# EAGLE design tako (EAGLE 7.3.0)
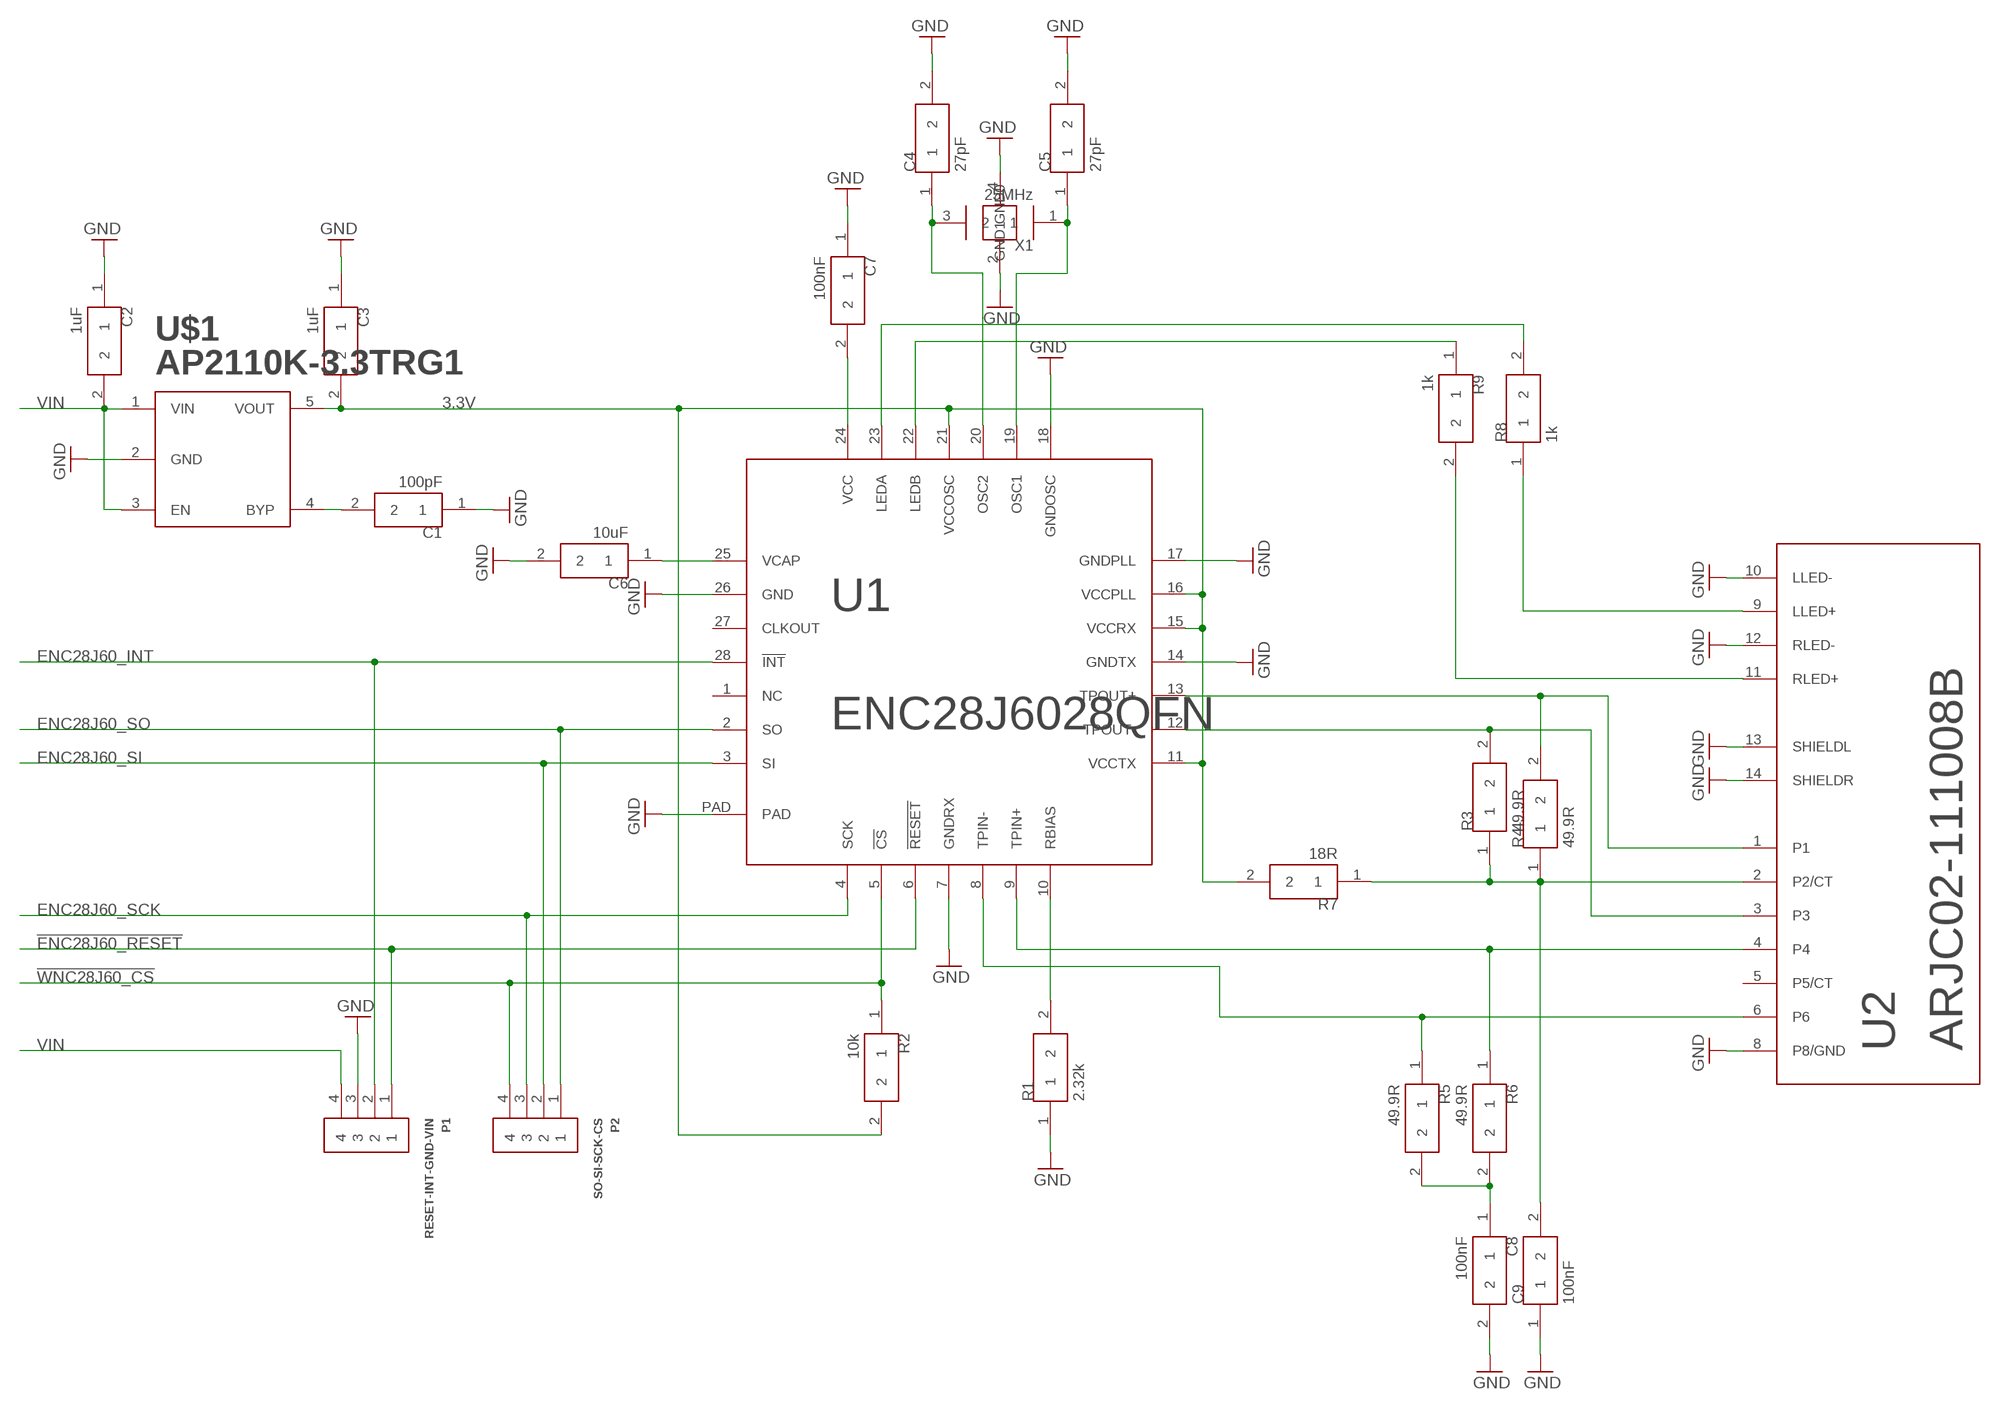
[diagram p0: schematic, sheet 1]

## Parts
C1  100pF  CAP0805  [0805]
C2  1uF  CAP0805  [0805]
C3  1uF  CAP0805  [0805]
C4  27pF  CAP0805  [0805]
C5  27pF  CAP0805  [0805]
C6  10uF  CAP0805  [0805]
C7  100nF  CAP0805  [0805]
C8  100nF  CAP0805  [0805]
C9  100nF  CAP0805  [0805]
P1  RESET-INT-GND-VIN  PIN_4  [PIN_4]
P2  SO-SI-SCK-CS  PIN_4  [PIN_4]
R1  2.32k  RES0805  [0805]
R2  10k  RES0805  [0805]
R3  49.9R  RES0805  [0805]
R4  49.9R  RES0805  [0805]
R5  49.9R  RES0805  [0805]
R6  49.9R  RES0805  [0805]
R7  18R  RES0805  [0805]
R8  1k  RES0805  [0805]
R9  1k  RES0805  [0805]
U1  ENC28J6028QFN  [28-QFN]
U2  ARJC02-111008B  [ARJC02-111008B]
U$1  AP2110K-3.3TRG1  AP2110  [SOT23-5]
X1  25MHz  XTAL_GNDSMD_3225  [XTAL_3225]

## Nets
3.3V: C3.2 R2.2 R7.2 U1.11(VCCTX) U1.15(VCCRX) U1.16(VCCPLL) U1.21(VCCOSC) U$1.5(VOUT)
!ENC28J60_RESET: P1.1 U1.6(!RESET)
!WNC28J60_CS: P2.4 R2.1 U1.5(!CS)
ENC28J60_INT: P1.2 U1.28(!INT)
ENC28J60_SCK: P2.3 U1.4(SCK)
ENC28J60_SI: P2.2 U1.3(SI)
ENC28J60_SO: P2.1 U1.2(SO)
GND: C1.1 C2.1 C3.1 C4.2 C5.2 C6.2 C7.1 C8.2 C9.1 P1.3 R1.1 U1.7(GNDRX) U1.14(GNDTX) U1.17(GNDPLL) U1.18(GNDOSC) U1.26(GND) U1.PAD U2.8(P8/GND) U2.10(LLED-) U2.12(RLED-) U2.13(SHIELDL) U2.14(SHIELDR) U$1.2(GND) X1.2(GND0) X1.4(GND1)
N$1: C4.1 U1.20(OSC2) X1.3
N$2: C5.1 U1.19(OSC1) X1.1
N$3: C1.2 U$1.4(BYP)
N$4: C6.1 U1.25(VCAP)
N$5: C7.2 U1.24(VCC)
N$6: R1.2 U1.10(RBIAS)
N$8: R6.1 U1.9(TPIN+) U2.4
N$9: R5.1 U1.8(TPIN-) U2.6
N$10: R3.2 U1.12(TPOUT-) U2.3
N$11: R4.2 U1.13(TPOUT+) U2.1
N$12: C8.1 R5.2 R6.2
N$13: R9.1 U1.22(LEDB)
N$14: R8.2 U1.23(LEDA)
N$15: R8.1 U2.9(LLED+)
N$16: C9.2 R3.1 R4.1 R7.1 U2.2(P2/CT)
N$17: R9.2 U2.11(RLED+)
VIN: C2.2 P1.4 U$1.1(VIN) U$1.3(EN)
Unconnected: U1.1(NC) U1.27(CLKOUT) U2.5(P5/CT)

## Library data of the parts
C1-C9 = dooba:CAP
P1 P2 = dooba:PIN_4
R1-R9 = dooba:RES
U1 = dooba:ENC28J60
U2 = dooba:ARJC02-111008B
U$1 = dooba:AP2110
X1 = dooba:XTAL_GND

## Board
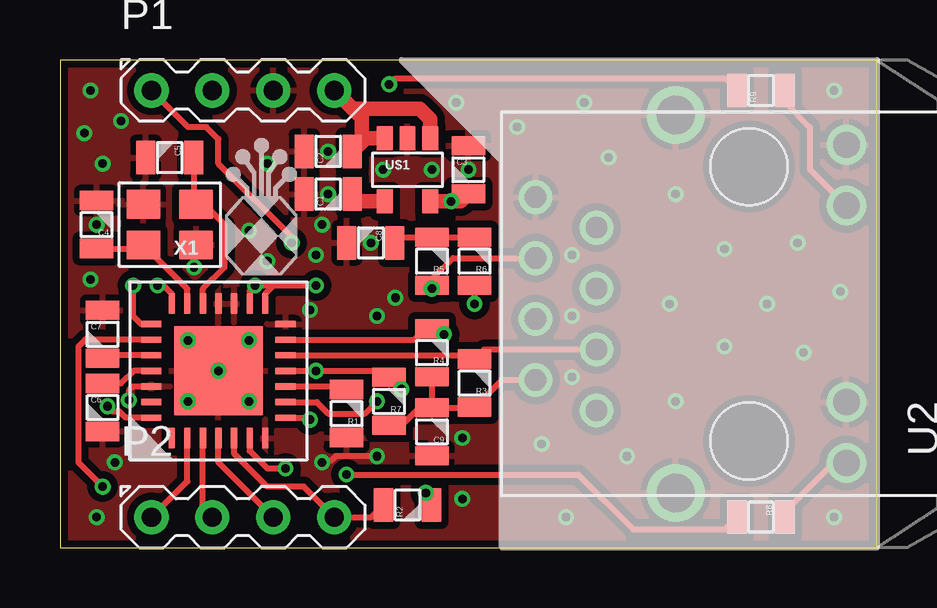
[diagram p1: board, top side]
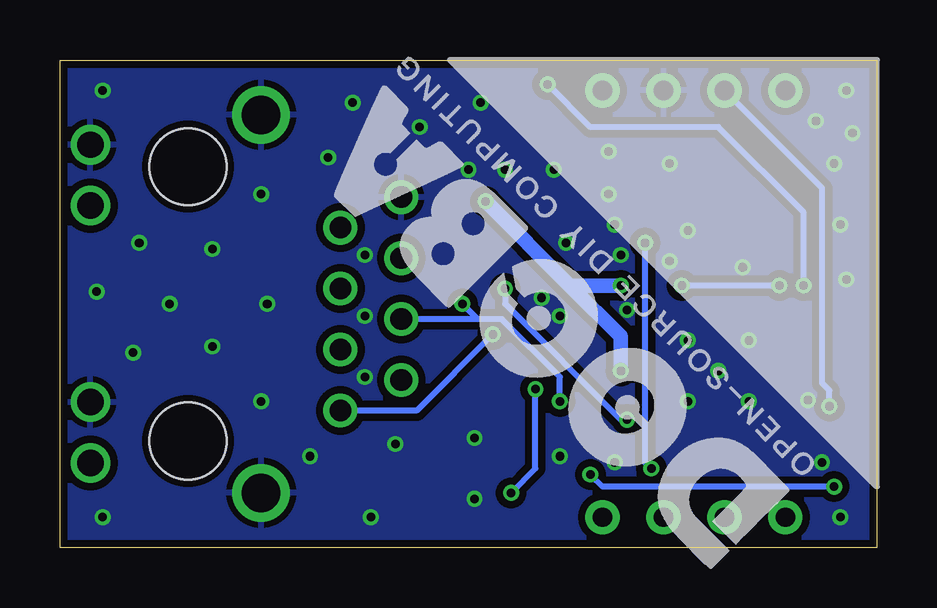
[diagram p2: board, bottom side, seen from below]

Size 34.04 x 20.32 mm. Coordinates in mm from the lower left corner, seen from the top.
Outline: 0,20.32 0,0 34.04,0 34.04,20.32 0,20.32
Copper layers (1*16): Top 0.035mm / dielectric 1.5mm / Bottom 0.035mm
Design rules "dooba": minimum track width 6mil, minimum drill 12mil, track to track 6mil, track to pad 6mil, pad to pad 6mil, via to via 6mil, smd to smd 0mil, copper to edge 10mil, drill to drill 10mil, minimum pad ring 10mil, minimum via ring 6mil, stop-mask expansion 2mil, vias tented up to drill 25mil, thermal gap 10mil

### Footprints (pad centres in the part's own frame; a part is rotated, then mirrored left to right if it is on the bottom)
0805 = smd 0.8 x 1.4: 1 -1,0; 2 1,0
PIN_4 = drill 0.8 pad 1.422: 1 -3.81,0; 2 -1.27,0; 3 1.27,0; 4 3.81,0
28-QFN = smd 0.85 x 0.26: 1 -2.8,1.95; 2 -2.8,1.3; 3 -2.8,0.65; 4 -2.8,0; 5 -2.8,-0.65; 6 -2.8,-1.3; 7 -2.8,-1.95; 15 2.8,-1.95; 16 2.8,-1.3; 17 2.8,-0.65; 18 2.8,0; 19 2.8,0.65; 20 2.8,1.3; 21 2.8,1.95 | smd 0.26 x 0.85: 8 -1.95,-2.8; 9 -1.3,-2.8; 10 -0.65,-2.8; 11 0,-2.8; 12 0.65,-2.8; 13 1.3,-2.8; 14 1.95,-2.8; 22 1.95,2.8; 23 1.3,2.8; 24 0.65,2.8; 25 0,2.8; 26 -0.65,2.8; 27 -1.3,2.8; 28 -1.95,2.8 | smd 3.7 x 3.7: PAD 0,0
ARJC02-111008B = drill 0.9: 1 -4.445,6.6; 2 -3.175,9.14; 3 -1.905,6.6; 4 -0.635,9.14; 5 0.635,6.6; 6 1.905,9.14; 7 3.175,6.6; 8 4.445,9.14 | drill 1.1: 9 -6.63,-3.81; 10 -4.09,-3.81; 11 4.09,-3.81; 12 6.63,-3.81 | drill 1.6: 13 -7.875,3.3; 14 7.875,3.3 | hole 3.2: -5.715,0.25; 5.715,0.25
SOT23-5 = smd 0.66 x 1: 1 0.95,1.315; 2 0,1.315; 3 -0.95,1.315; 4 -0.95,-1.315; 5 0.95,-1.315
XTAL_3225 = smd 1.4 x 1.2: 1 -1.1,-0.85; 2 1.1,-0.85; 3 1.1,0.85; 4 -1.1,0.85

### Placement (x,y rotation side)
C1  11.18,14.73 0 top
C2  11.18,16.51 0 top
C3  17.02,15.75 270 top
C4  1.52,13.46 90 top
C5  4.57,16.26 180 top
C6  1.78,5.84 270 top
C7  1.78,8.89 270 top
C8  12.95,12.7 180 top
C9  15.49,4.83 90 top
P1  7.62,19.05 0 top
P2  7.62,1.27 0 top
R1  11.94,5.59 90 top
R2  14.48,1.78 0 top
R3  17.27,6.86 90 top
R4  15.49,8.13 90 top
R5  15.49,11.94 90 top
R6  17.27,11.94 90 top
R7  13.72,6.1 90 top
R8  29.21,1.27 180 top
R9  29.21,19.05 0 top
U1  6.6,7.37 90 top
U2  28.96,10.16 90 top
U$1  14.48,15.75 0 top
X1  4.57,13.46 180 top

### Tracks (layer width: path | path; a pad name or v marks a point on that pad's centre or on a via)
3.3V  (via drill 0.36)
  Top 0.254: U1.11 v10.67,7.37 13.45,7.37 R7.2 13.73,7.1 v14.22,6.6 | U1.21 4.65,10.59 4.32,10.92 v4.06,10.92 | U1.16 7.9,10.7 v8.13,10.92 8.89,10.92 | U1.15 8.55,10.59 8.89,10.92 | v10.67,10.92 8.89,10.92 | R2.2 15.24,2.02 v15.24,2.29
  Top 0.61: U$1.5 v16.3,14.43 16.7,14.43 C3.2
  Bottom 0.254: v4.06,10.92 v8.13,10.92 | v15.24,2.29 14.22,3.3 v14.22,6.6
  Bottom 0.61: v16.3,14.43 12.79,10.92 | 12.79,10.92 v10.67,10.92 | v10.67,7.37 10.67,8.8 12.79,10.92
!ENC28J60_RESET  (via drill 0.36)
  Top 0.254: U1.6 7.9,4.03 8.64,3.3 v9.4,3.3 | v9.65,12.7 9.65,12.95 6.6,16 6.6,17.02 6.1,17.53 5.33,17.53 P1.1
  Bottom 0.254: v9.4,3.3 9.65,3.56 v9.65,12.7
!WNC28J60_CS
  Top 0.254: U1.5 7.25,3.92 8.64,2.54 10.16,2.54 P2.4 12.97,1.27 R2.1
ENC28J60_INT  (via drill 0.36)
  Top 0.254: U1.28 2.74,5.42 2.49,5.66 2.18,5.66 1.98,5.87 v1.98,5.89
  Bottom 0.254: P1.2 2.29,14.99 2.29,6.86 1.98,6.55 v1.98,5.89
ENC28J60_SCK
  Top 0.254: P2.3 6.6,3.56 U1.4
ENC28J60_SI
  Top 0.254: P2.2 5.95,1.67 U1.3
ENC28J60_SO
  Top 0.254: P2.1 5.3,2.76 U1.2
GND  (via drill 0.36)
  Top 0.254: U1.26 3.03,6.72 2.87,6.55 v2.87,6.15 | v13.21,3.81 11.48,3.81 11.3,3.63 10.97,3.63
  other vias: 1.52,1.27 2.29,3.56 10.92,3.56 16.76,4.57 13.97,10.41 10.67,12.19 10.92,13.46 8.64,11.94 7.87,13.21 5.59,11.68 1.78,16 1.27,11.18 1.52,13.46 1.27,19.05 2.54,17.78 8.64,16 11.18,16.51 11.18,14.73 12.95,12.7 13.21,9.65 10.41,9.91 1.02,17.27 16.51,18.54 19.05,17.53 21.84,18.54 16.76,2.03 21.08,1.27 23.62,3.81 20.07,4.32 21.34,7.11 21.34,9.65 21.34,12.19 22.86,16.26 25.65,14.73 25.4,10.16 25.65,6.1 27.69,8.38 27.69,12.45 29.46,10.16 30.73,12.7 30.99,8.13 32.51,10.67 32.26,19.05 32.26,1.27 13.46,15.75 15.49,15.75 17.02,15.75 5.33,8.64 7.87,8.64 7.87,6.1 5.33,6.1 6.6,7.37
  pour Top (isolate 0.305): 0,20.32 0,0 34.04,0 34.04,20.32
  pour Bottom (isolate 0.305): 0,20.32 0,0 34.04,0 34.04,20.32
N$1
  Top 0.254: U1.20 5.3,10.78 X1.3 3.32,12.46 C4.1
N$2
  Top 0.254: U1.19 5.95,10.78 6.86,11.68 6.86,13.46 6.1,14.22 5.76,14.22 X1.1 5.57,14.41 C5.1
N$3
  Top 0.61: C1.2 12.48,14.43 U$1.4
N$4
  Top 0.254: U1.25 3.06,7.37 2.54,6.84 C6.1
N$5
  Top 0.254: U1.24 2.16,8.02 C7.2
N$6
  Top 0.254: U1.10 11.81,6.72 R1.2
N$8  (via drill 0.36)
  Top 0.254: U1.9 10.7,6.07 11.18,5.59 12.7,5.59 v13.21,6.1 | v17.27,10.16 R6.1
  Bottom 0.254: 16.64,9.53 U2.4 | 16.64,9.53 v17.27,10.16 | v13.21,6.1 13.21,7.11 15.62,9.53 16.64,9.53
N$9  (via drill 0.36)
  Top 0.254: U1.8 10.33,5.42 v10.41,5.33 | U2.6 16.38,12.07 15.49,11.18 R5.1 v15.49,10.79
  Bottom 0.254: v10.41,5.33 10.67,5.33 15.49,10.16 v15.49,10.79
N$10
  Top 0.254: U1.12 17.11,8.02 R3.2 17.67,8.25 U2.3
N$11  (via drill 0.36)
  Top 0.254: U1.13 14.76,8.67 14.99,8.89 15.26,8.89 R4.2 15.73,8.89 v16,8.89
  Bottom 0.254: v16,8.89 19.18,5.71 U2.1
N$12
  Top 0.254: C8.1 14.19,12.94 R5.2 R6.2
N$13  (via drill 0.36)
  Top 0.254: U1.22 3.38,9.32 3.05,9.65 v3.05,10.92 | v13.72,19.3 13.97,19.56 27.7,19.56 R9.1
  Bottom 0.254: v3.05,10.92 3.05,13.97 6.6,17.53 11.94,17.53 v13.72,19.3
N$14  (via drill 0.36)
  Top 0.254: U1.23 1.05,8.67 0.76,8.38 0.76,3.56 v1.78,2.54 | v11.94,3.05 21.59,3.05 23.88,0.76 27.7,0.76 R8.2
  Bottom 0.254: v1.78,2.54 11.43,2.54 v11.94,3.05
N$15
  Top 0.254: R8.1 30.21,1.51 32.26,3.56 32.74,3.56 U2.9
N$16
  Top 0.254: R7.1 13.73,5.08 14.22,5.08 14.97,5.83 C9.2 | C9.2 17.24,5.83 R3.1 18.4,6.99 U2.2 | R4.1 C9.2
N$17
  Top 0.254: R9.2 30.21,18.56 31.24,17.53 31.24,15.77 U2.11
VIN
  Top 0.61: U$1.1 15.43,17.85 14.99,18.29 12.19,18.29 | 12.19,18.29 P1.4 | U$1.3 12.73,17.06 12.56,16.9 | 12.56,16.9 C2.2 | 12.19,18.29 12.56,17.92 12.56,16.9